# EAGLE design mainboard (EAGLE 9.1.0)
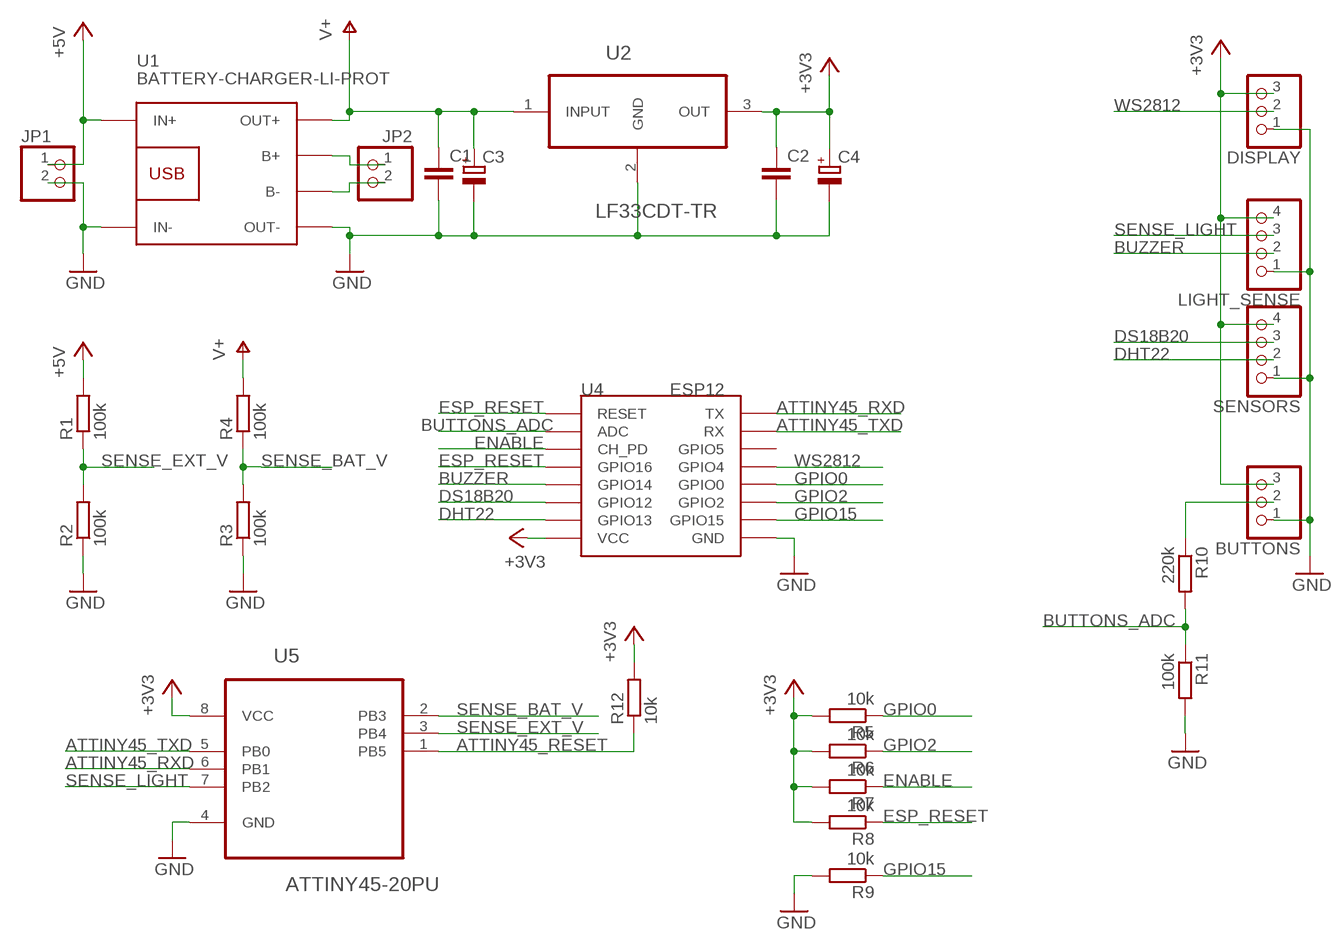
[diagram p0: schematic, sheet 1]

## Parts
BUTTONS  PINHD-1X3  [1X03]
C1  C-EUC1206  [C1206]
C2  C-EUC1206  [C1206]
C3  CPOL-EUE2-5  [E2-5]
C4  CPOL-EUE2-5  [E2-5]
DISPLAY  PINHD-1X3  [1X03]
JP1  PINHD-1X2  [1X02]
JP2  PINHD-1X2  [1X02]
LIGHT_SENSE  PINHD-1X4  [1X04]
R1  100k  R-EU_R1206  [R1206]
R2  100k  R-EU_R1206  [R1206]
R3  100k  R-EU_R1206  [R1206]
R4  100k  R-EU_R1206  [R1206]
R5  10k  R-EU_R1206  [R1206]
R6  10k  R-EU_R1206  [R1206]
R7  10k  R-EU_R1206  [R1206]
R8  10k  R-EU_R1206  [R1206]
R9  10k  R-EU_R1206  [R1206]
R10  220k  R-EU_R1206  [R1206]
R11  100k  R-EU_R1206  [R1206]
R12  10k  R-EU_R1206  [R1206]
SENSORS  PINHD-1X4  [1X04]
U1  BATTERY-CHARGER-LI-PROT  [BATTERY-CHARGER-LI-PROT]
U2  LF33CDT-TR  [TO228P972X240-3N]
U4  ESP12  [ESP12]
U5  ATTINY45-20PU  [DIP254P762X533-8]

## Nets
+3V3: BUTTONS.3 C2.1 C4.+ DISPLAY.3 LIGHT_SENSE.4 R5.2 R6.2 R7.2 R8.2 R12.2 SENSORS.4 U2.3(OUT) U4.VCC U5.8(VCC)
+5V: JP1.1 R1.2 U1.IN+
ATTINY45_RESET: R12.1 U5.1(PB5)
ATTINY45_RXD: U4.TX U5.6(PB1)
ATTINY45_TXD: U4.RX U5.5(PB0)
BUTTONS_ADC: R10.2 R11.1 U4.ADC
BUZZER: LIGHT_SENSE.2 U4.GPIO14
DHT22: SENSORS.2 U4.GPIO13
DS18B20: SENSORS.3 U4.GPIO12
ENABLE: R7.1 U4.CH_PD
ESP_RESET: R8.1 U4.GPIO16 U4.RESET
GND: BUTTONS.1 C1.2 C2.2 C3.- C4.- DISPLAY.1 JP1.2 LIGHT_SENSE.1 R2.1 R3.1 R9.2 R11.2 SENSORS.1 U1.IN- U1.OUT- U2.2(GND) U4.GND U5.4(GND)
GPIO0: R5.1 U4.GPIO0
GPIO2: R6.1 U4.GPIO2
GPIO15: R9.1 U4.GPIO15
N$1: BUTTONS.2 R10.1
N$3: JP2.1 U1.B+
N$4: JP2.2 U1.B-
SENSE_BAT_V: R3.2 R4.1 U5.2(PB3)
SENSE_EXT_V: R1.1 R2.2 U5.3(PB4)
SENSE_LIGHT: LIGHT_SENSE.3 U5.7(PB2)
V+: C1.1 C3.+ R4.2 U1.OUT+ U2.1(INPUT)
WS2812: DISPLAY.2 U4.GPIO5(GPIO4)
Unconnected: U4.GPIO4(GPIO5)

## Library data of the parts
BUTTONS DISPLAY = pinhead:PINHD-1X3: PIN HEADER
C1 C2 = rcl:C-EU: CAPACITOR, European symbol; SPICEPREFIX: C
C3 C4 = rcl:CPOL-EU: POLARIZED CAPACITOR, European symbol; SPICEPREFIX: C
JP1 JP2 = pinhead:PINHD-1X2: PIN HEADER
LIGHT_SENSE SENSORS = pinhead:PINHD-1X4: PIN HEADER
R1-R12 = rcl:R-EU_: RESISTOR, European symbol; SPICEPREFIX: R
U1 = diy-modules:BATTERY-CHARGER-LI-PROT: Lithium Battery 5V Charger with protection circuit More details available here: http://www.instructables.com/id/DIY-Lithium-ion-Battery-Charger/step4/TP4056-based-lithium-ion-battery-charger-module/ Click here to find device on ebay.com <http://www.ebay.com/sch/tp4056+charger+usb+protection>
U2 = LF33CDT-TR:LF33CDT-TR: LDO, 0.45VDO, 1A, 3.3V, 1%, 3TO252; AVAILABILITY: Unavailable; DESCRIPTION: LFXX Series 500 mA 3.3 V Fixed VLDO Voltage Regulator with Inhibit - TO-252; MF: STMicroelectronics; MP: LF33CDT-TR; PACKAGE: TO-252-3 STMicroelectronics; PRICE: None
U4 = esp826612q:ESP12
U5 = ATTINY45-20PU:ATTINY45-20PU: 8-bit Microcontroller with 2/4/8KBytes In-System Programmable Flash; AVAILABILITY: Unavailable; DESCRIPTION: Embedded microcontroller ATTINY45-20PU PDIP 8 Microchip Technology 8-Bit 20 MHz I/O number 6; MF: Microchip; MP: ATTINY45-20PU; PACKAGE: DIP-8 Microchip; PRICE: None

## Board
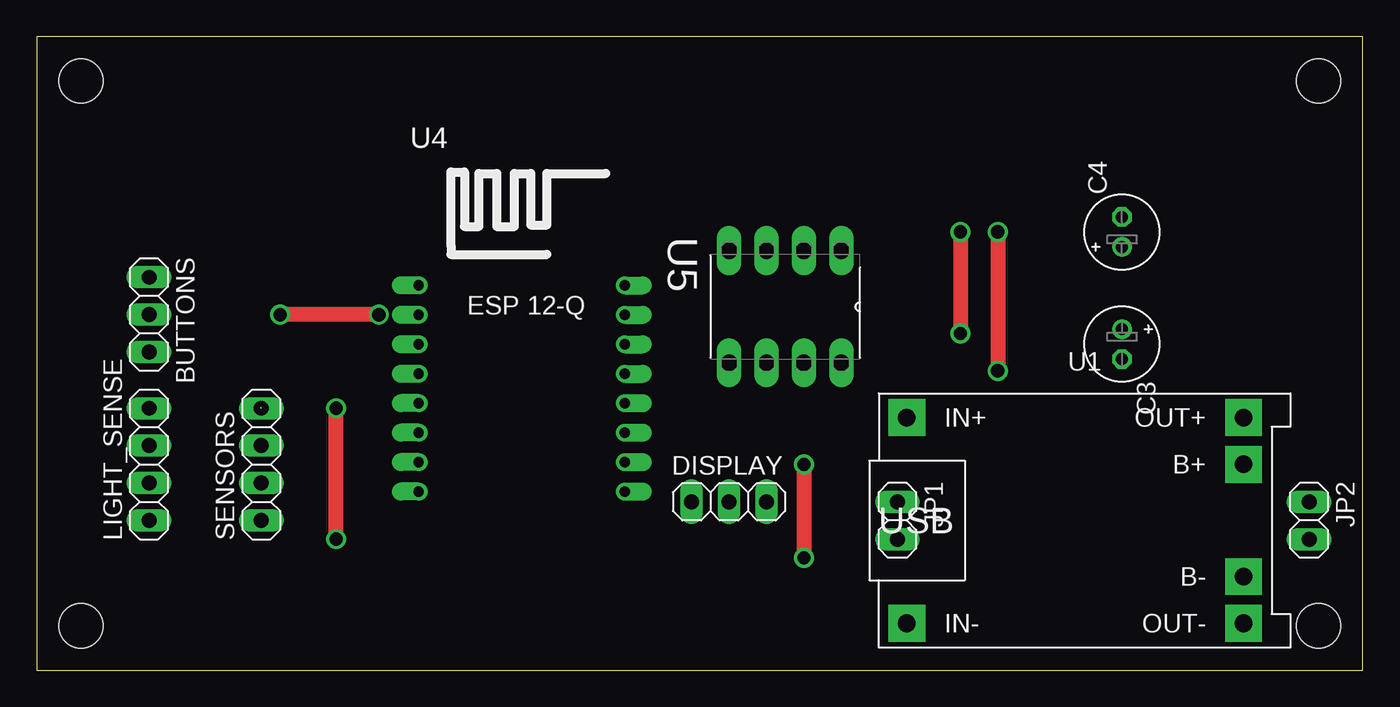
[diagram p1: board, top side]
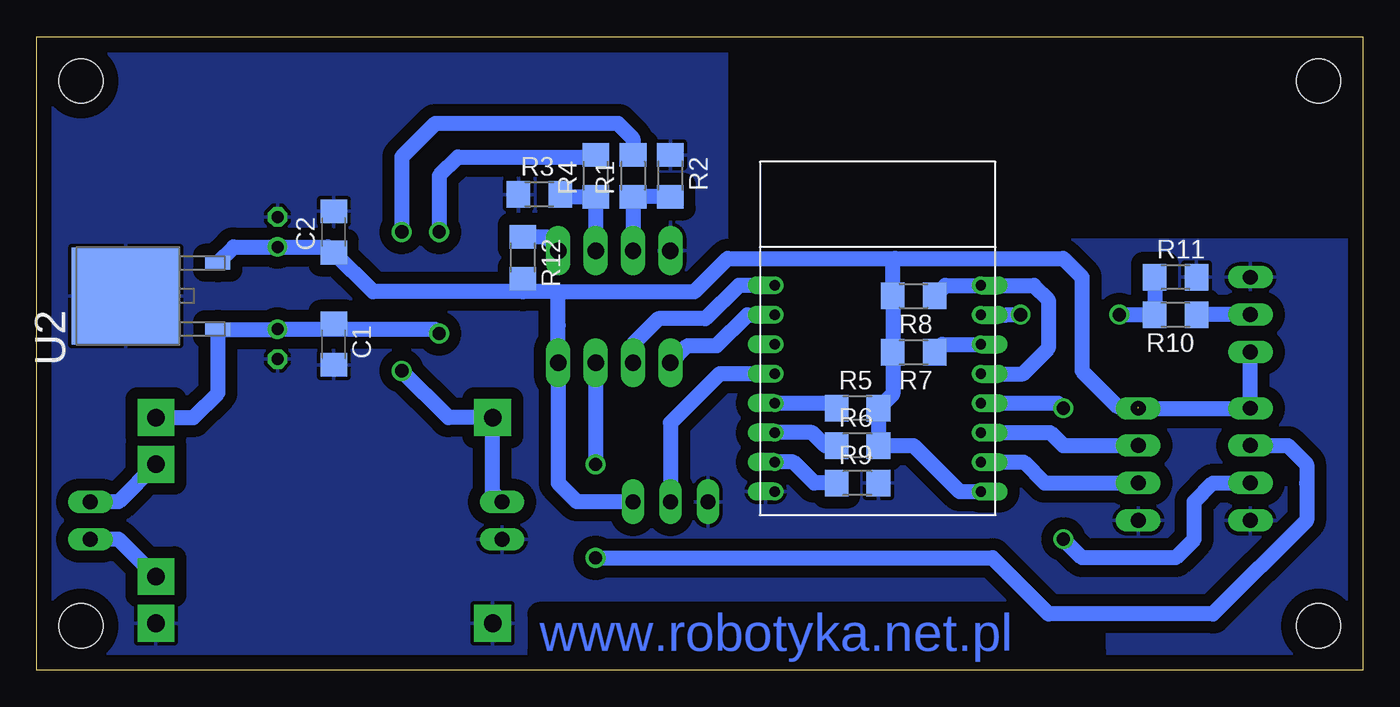
[diagram p2: board, bottom side, seen from below]

Size 90 x 43 mm. Coordinates in mm from the lower left corner, seen from the top.
Outline: 0,0 90,0 90,43 0,43 0,0
Copper layers (1*16): Top 0.035mm / dielectric 1.5mm / Bottom 0.035mm
Design rules "default *": minimum track width 6mil, minimum drill 0.35mm, track to track 32mil, track to pad 24mil, pad to pad 6mil, via to via 6mil, smd to smd 6mil, copper to edge 40mil, drill to drill 6mil, minimum pad ring 10mil, minimum via ring 8mil, stop-mask expansion 4mil, vias tented up to drill 0mil, thermal gap 10mil
Holes 3 mm at 3,3 3,40 87,40 87,3

### Footprints (pad centres in the part's own frame; a part is rotated, then mirrored left to right if it is on the bottom)
1X03 = drill 1.016 long: 1 -2.54,0; 2 0,0; 3 2.54,0
C1206 = smd 1.6 x 1.8: 1 -1.4,0; 2 1.4,0
E2-5 = drill 0.813 pad 1.27: + -1.016,0 | drill 0.813 pad 1.27 octagon: - 1.016,0
1X02 = drill 1.016 long: 1 -1.27,0; 2 1.27,0
1X04 = drill 1.016 long: 1 -3.81,0; 2 -1.27,0; 3 1.27,0; 4 3.81,0
R1206 = smd 1.6 x 1.803: 1 -1.422,0; 2 1.422,0
BATTERY-CHARGER-LI-PROT = drill 1.2 pad 2.5 square: B+ 10.795,3.81; B- 10.795,-3.81; IN+ -12.065,6.985; IN- -12.065,-6.985; OUT+ 10.795,6.985; OUT- 10.795,-6.985
TO228P972X240-3N = smd 0.94 x 1.702: 1 -2.261,-6.096; 3 2.261,-6.096 | smd 6.604 x 7.315: 2 0,0.152
ESP12 = drill 0.7 offset: ADC -7.1,3.8; CH_PD -7.1,1.8; GND 6.9,-8.2; GPIO0 6.9,-2.2; GPIO2 6.9,-4.2; GPIO4 6.9,1.8; GPIO5 6.9,-0.2; GPIO12 -7.1,-4.2; GPIO13 -7.1,-6.2; GPIO14 -7.1,-2.2; GPIO15 6.9,-6.2; GPIO16 -7.1,-0.2; RESET -7.1,5.8; RX 6.9,3.8; TX 6.9,5.8; VCC -7.1,-8.2
DIP254P762X533-8 = drill 1.118 long: 1 -3.81,3.81; 2 -3.81,1.27; 3 -3.81,-1.27; 4 -3.81,-3.81; 5 3.81,-3.81; 6 3.81,-1.27; 7 3.81,1.27; 8 3.81,3.81

### Placement (x,y rotation side)
BUTTONS  7.62,24.13 270 top
C1  69.85,22.13 270 bottom
C2  69.85,29.75 90 bottom
C3  73.66,22.13 270 top
C4  73.66,29.75 90 top
DISPLAY  46.99,11.43 0 top
JP1  58.42,10.16 270 top
JP2  86.36,10.16 270 top
LIGHT_SENSE  7.62,13.97 90 top
R1  49.53,33.56 90 bottom
R2  46.99,33.56 270 bottom
R3  55.88,32.29 0 bottom
R4  52.07,33.56 90 bottom
R5  34.29,17.78 0 bottom
R6  34.29,15.24 0 bottom
R7  30.48,21.59 180 bottom
R8  30.48,25.4 180 bottom
R9  34.29,12.7 0 bottom
R10  12.7,24.13 180 bottom
R11  12.7,26.67 0 bottom
R12  57,28 270 bottom
SENSORS  15.24,13.97 90 top
U1  71.12,10.16 0 top
U2  83.82,25.4 90 bottom
U4  33.02,20.32 0 top
U5  50.8,24.67 270 top

### Tracks (layer width: path | path; a pad name or v marks a point on that pad's centre or on a via)
+3V3  (1 unrouted)
  Bottom 1.016: R8.2 R7.2 31.9,18.75 R5.2 R6.2 30.48,15.24 27.36,12.12 U4.VCC | R8.2 31.75,25.55 | 15.24,17.88 16.61,17.88 19.05,20.32 19.05,26.67 20.33,27.95 31.75,27.95 | SENSORS.4 LIGHT_SENSE.4 BUTTONS.3 | DISPLAY.3 53.34,11.43 54.61,12.7 U5.8 54.61,23.4 54.61,25.69 | 54.61,25.69 45.37,25.69 43.11,27.95 31.75,27.95 | R8.2 31.9,27.8 31.75,27.95 | U2.3 76.65,28.73 C4.+ 70.23,28.73 C2.1 67.19,25.69 57,25.69 | 54.61,25.69 57,25.69 | R12.2 57,25.69
+5V  (via drill 0.9)
  Top 1.016: v65.23,29.75 v65.23,20.32
  Bottom 1.016: R1.2 49.53,36.1 50.54,37.11 62.95,37.11 65.23,34.83 v65.23,29.75 | JP1.1 59.05,12.06 U1.IN+ 62.05,17.14 v65.23,20.32
ATTINY45_RESET
  Bottom 1.016: R12.1 55.42,29.42 54.61,28.61 U5.1
ATTINY45_RXD
  Bottom 1.016: U4.TX 42.35,26.12 44.61,23.86 47.8,23.86 49.53,22.13 U5.6
ATTINY45_TXD
  Bottom 1.016: U5.5 45.82,22.03 43.85,22.03 41.76,24.12 U4.RX
BUTTONS_ADC  (via drill 0.9)
  Top 1.016: v23.22,24.13 v16.51,24.13
  Bottom 1.016: U4.ADC 24.14,24.12 24.13,24.13 v23.22,24.13 | v16.51,24.13 15.24,24.13 R10.2 R11.1
BUZZER  (via drill 0.9)
  Top 1.016: v20.32,8.89 v20.32,17.78
  Bottom 1.016: U4.GPIO14 20.66,18.12 v20.32,17.78 | LIGHT_SENSE.2 10.16,12.7 11.43,11.43 11.43,8.89 12.7,7.62 19.05,7.62 v20.32,8.89
DHT22
  Bottom 1.016: U4.GPIO13 23.01,14.12 21.59,12.7 SENSORS.2
DS18B20
  Bottom 1.016: U4.GPIO12 21.2,16.12 20.32,15.24 SENSORS.3
ENABLE
  Bottom 1.016: R7.1 28.53,22.12 U4.CH_PD
ESP_RESET
  Bottom 1.016: U4.GPIO16 23.06,20.12 21.34,21.84 21.34,25.15 22.31,26.12 U4.RESET 28.34,26.12 R8.1
GND
  pour Bottom: 0,0 92.33,0 92.33,41.91 43.18,41.91 43.18,29.21 24.13,29.21 0,29.21
GPIO0
  Bottom 1.016: U4.GPIO0 36.05,18.12 R5.1
GPIO2
  Bottom 1.016: R6.1 36.5,15.24 37.38,16.12 U4.GPIO2
GPIO15
  Bottom 1.016: R9.1 37.23,12.7 38.65,14.12 U4.GPIO15
N$1
  Bottom 1.016: BUTTONS.2 R10.1
N$3
  Bottom 1.016: U1.B+ 84.45,11.43 JP2.1
N$4
  Bottom 1.016: U1.B- 84.45,8.89 JP2.2
SENSE_BAT_V
  Bottom 1.016: R3.2 54.31,32.14 R4.1 U5.2
SENSE_EXT_V
  Bottom 1.016: R2.2 R1.1 U5.3
SENSE_LIGHT  (via drill 0.9)
  Top 1.016: v52.07,13.97 v52.07,7.62
  Bottom 1.016: LIGHT_SENSE.3 5.08,15.24 3.81,13.97 3.81,12.7 3.81,10.16 10.16,3.81 21.32,3.81 25.13,7.62 v52.07,7.62 | U5.7 v52.07,13.97
V+  (via drill 0.9)
  Top 1.016: v62.69,29.75 v62.69,22.86
  Bottom 1.016: v62.69,29.75 62.69,33.56 61.42,34.83 52.22,34.83 R4.2 | 77.7,23.11 U2.1 73.67,23.14 C3.+ 69.85,23.15 | 77.7,23.11 77.47,23.11 | U1.OUT+ 79.38,17.14 77.7,18.82 77.7,23.11 | 69.85,23.15 62.98,23.15 v62.69,22.86 | C1.1 69.85,23.15
WS2812
  Bottom 1.016: U4.GPIO5 43.65,20.12 46.99,16.78 DISPLAY.2

### Text on the board
Bottom: www.robotyka.net.pl